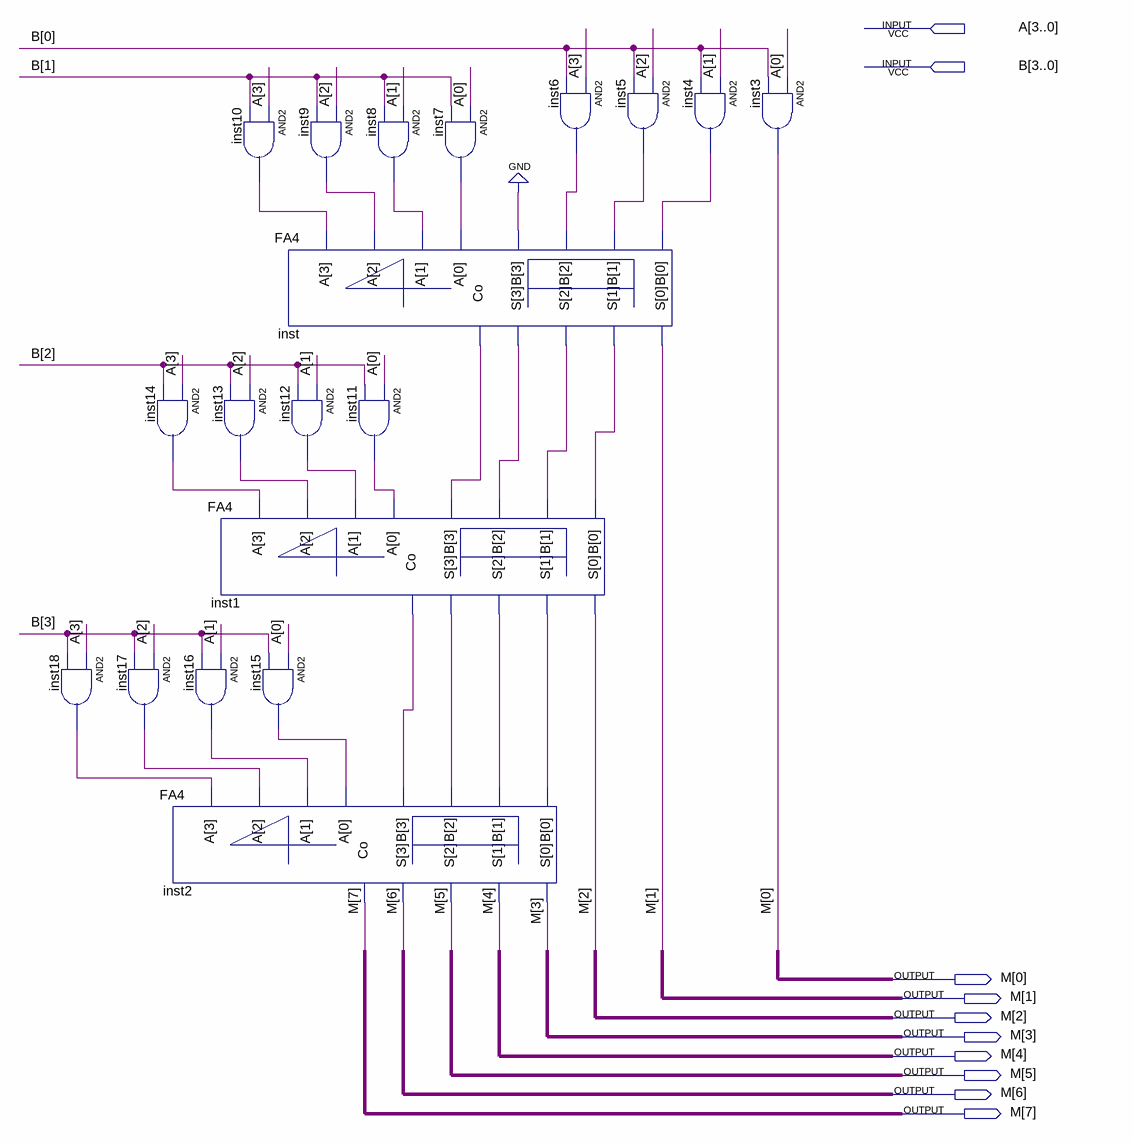
[diagram p0: schematic sheet]
// Quartus schematic MU4.bdf as structural Verilog: 19 symbols, 10 pins
module MU4 (
  input  [3:0] A,
  input  [3:0] B,
  output [7:0] M
);

  wire inst1_co, inst1_s, inst1_s_2, inst1_s_3, inst4_out, inst5_out, inst6_out, inst7_out, inst8_out,
       inst9_out, inst10_out, inst11_out, inst12_out, inst13_out, inst14_out, inst15_out, inst16_out,
       inst17_out, inst18_out, inst_co, inst_s, inst_s_2, inst_s_3;

  and inst18 (inst18_out, A[3], B[3]);
  and inst14 (inst14_out, A[3], B[2]);
  and inst17 (inst17_out, A[2], B[3]);
  FA4 inst2 (
    .B({inst1_co, inst1_s_3, inst1_s_2, inst1_s}), .A({inst18_out, inst17_out, inst16_out, inst15_out}),
    .Co(M[7]), .S(M[6:3]));
  and inst10 (inst10_out, A[3], B[1]);
  and inst13 (inst13_out, A[2], B[2]);
  FA4 inst1 (
    .B({inst_co, inst_s, inst_s_2, inst_s_3}), .A({inst14_out, inst13_out, inst12_out, inst11_out}),
    .Co(inst1_co), .S({inst1_s_3, inst1_s_2, inst1_s, M[2]}));
  and inst16 (inst16_out, A[1], B[3]);
  and inst9 (inst9_out, A[2], B[1]);
  FA4 inst (
    .B({1'b0, inst6_out, inst5_out, inst4_out}), .A({inst10_out, inst9_out, inst8_out, inst7_out}),
    .Co(inst_co), .S({inst_s, inst_s_2, inst_s_3, M[1]}));
  and inst12 (inst12_out, A[1], B[2]);
  and inst15 (inst15_out, A[0], B[3]);
  and inst8 (inst8_out, A[1], B[1]);
  and inst11 (inst11_out, A[0], B[2]);
  and inst7 (inst7_out, A[0], B[1]);
  and inst5 (inst5_out, A[2], B[0]);
  and inst6 (inst6_out, A[3], B[0]);
  and inst4 (inst4_out, A[1], B[0]);
  and inst3 (M[0], A[0], B[0]);
endmodule
